# EAGLE design trainiii_battery (EAGLE 9.4.2)
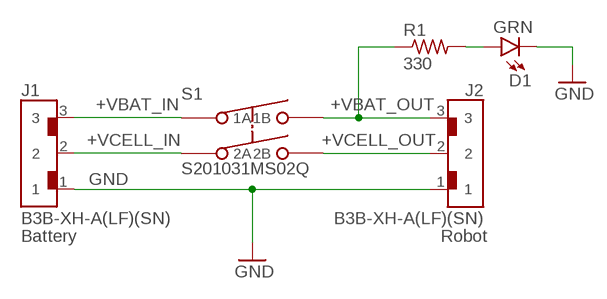
[diagram p0: schematic, sheet 1]

## Parts
D1  GRN  LED0603  [LED-0603]
J1  B3B-XH-A(LF)(SN)  [B3B-XH-A(LF)(SN)]
J2  B3B-XH-A(LF)(SN)  [B3B-XH-A(LF)(SN)]
R1  330  R-US_R0603  [R0603]
S1  S201031MS02Q  [S201]

## Nets
+VBAT_IN: J1.3 S1.1(1A)
+VBAT_OUT: J2.3 R1.1 S1.2(1B)
+VCELL_IN: J1.2 S1.4(2A)
+VCELL_OUT: J2.2 S1.5(2B)
GND: D1.C J1.1 J2.1
LED_IN: D1.A R1.2

## Notes on the sheet
- Battery | Robot

## Library data of the parts
D1 = SparkFun-LED:LED: LED (Generic) Standard schematic elements and footprints for 5mm, 3mm, 1206, and 0603 sized LEDs. Generic LEDs with no color specified.
J1 J2 = Trainiii Battery:B3B-XH-A(LF)(SN): B3B-XH-A(LF)(SN) CONN HEADER VERT 3POS 2.5MM
R1 = rcl:R-US_: RESISTOR, American symbol; SPICEPREFIX: R
S1 = Trainiii Battery:S201031MS02Q: S201031MS02Q SWITCH SLIDE DPST 6A 125V

## Board
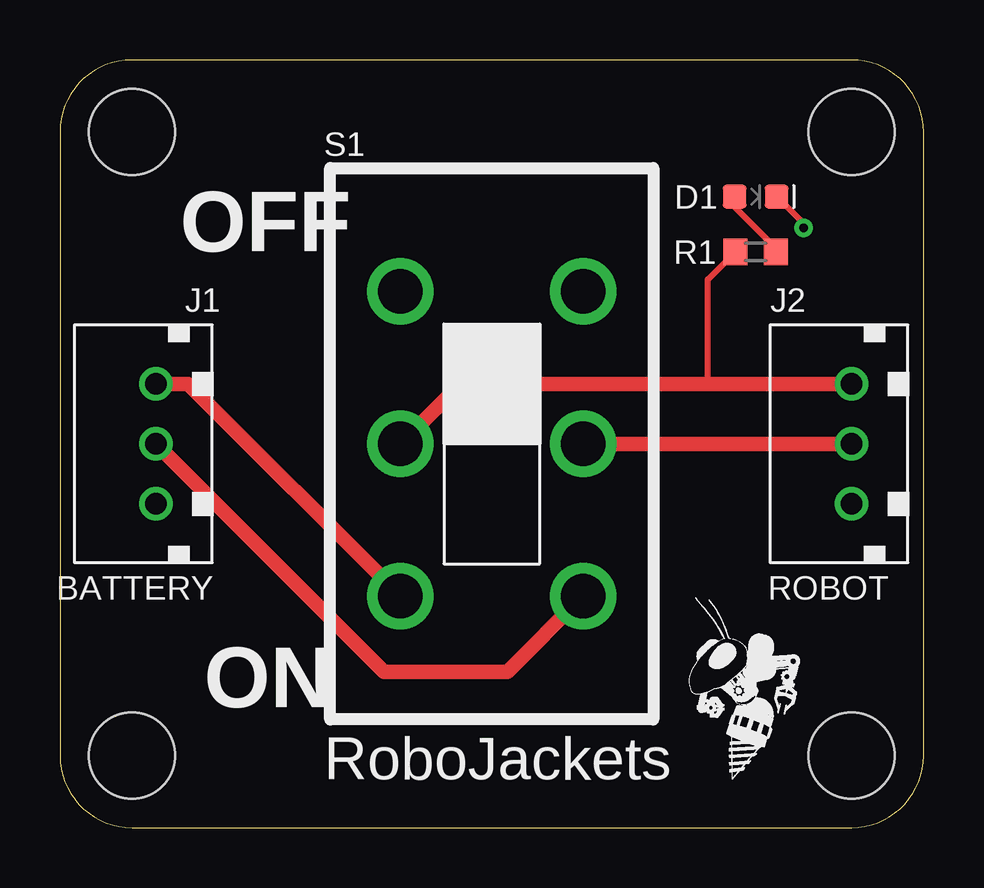
[diagram p1: board, top side]
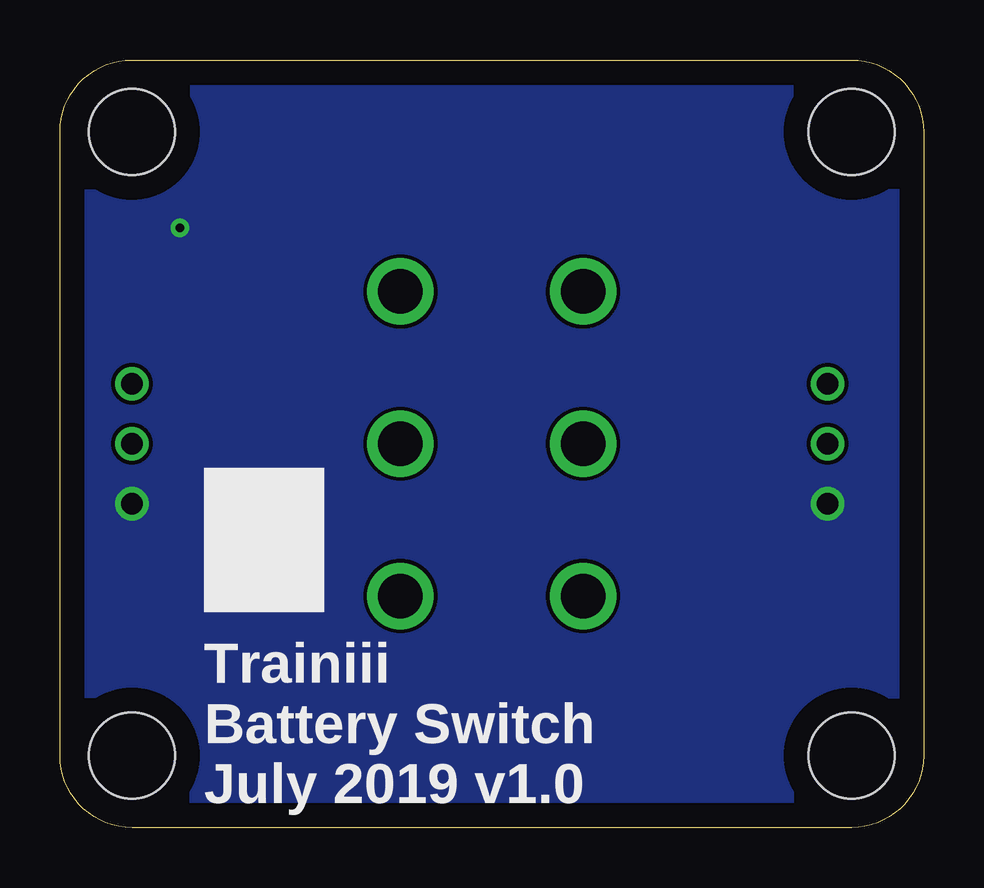
[diagram p2: board, bottom side, seen from below]

Size 36 x 32 mm. Coordinates in mm from the lower left corner, seen from the top.
Outline: 3,0 33,0 arc90 36,3 36,29 arc90 33,32 3,32 arc90 0,29 0,3 arc90 3,0
Copper layers (1*16): Top 0.035mm / dielectric 1.5mm / Bottom 0.035mm
Design rules "default": minimum track width 6mil, minimum drill 0.35mm, track to track 6mil, track to pad 6mil, pad to pad 6mil, via to via 6mil, smd to smd 6mil, copper to edge 40mil, drill to drill 6mil, minimum pad ring 10mil, minimum via ring 8mil, stop-mask expansion 4mil, vias tented up to drill 0mil, thermal gap 10mil
Holes 3.6 mm at 3,29 33,29 3,3 33,3

### Footprints (pad centres in the part's own frame; a part is rotated, then mirrored left to right if it is on the bottom)
LED-0603 = smd 1 x 1: A -0.877,0; C 0.877,0
B3B-XH-A(LF)(SN) = drill 0.9: 1 0,-2.5; 2 0,0; 3 0,2.5
R0603 = smd 1 x 1.1: 1 -0.85,0; 2 0.85,0
S201 = drill 1.85: 1 -3.81,-6.35; 2 -3.81,0; 3 -3.81,6.35; 4 3.81,-6.35; 5 3.81,0; 6 3.81,6.35

### Placement (x,y rotation side)
D1  29,26.3 0 top
J1  4,16 0 top
J2  33,16 0 top
R1  29,24 0 top
S1  18,16 0 top
U$2  [ROBOBUZZ_0.4X]  28,2 0 top

### Tracks (layer width: path | path; a pad name or v marks a point on that pad's centre or on a via)
+VBAT_IN
  Top 0.61: S1.1 5.34,18.5 J1.3
+VBAT_OUT
  Top 0.254: 27,18.5 27,22.85 R1.1
  Top 0.61: S1.2 16.69,18.5 27,18.5 J2.3
+VCELL_IN
  Top 0.61: J1.2 13.5,6.5 18.66,6.5 S1.4
+VCELL_OUT
  Top 0.61: S1.5 J2.2
GND  (via drill 0.35)
  Top 0.254: v31,25 31,25.18 D1.C
  pour Bottom (no thermals): 1,31 35,31 35,1 1,1
LED_IN
  Top 0.254: R1.2 29.85,24.15 28.12,25.88 D1.A

### Text on the board
tPlace: OFF | BATTERY | ROBOT | ON | RoboJackets
bPlace: Trainiii / Battery Switch / July 2019 v1.0